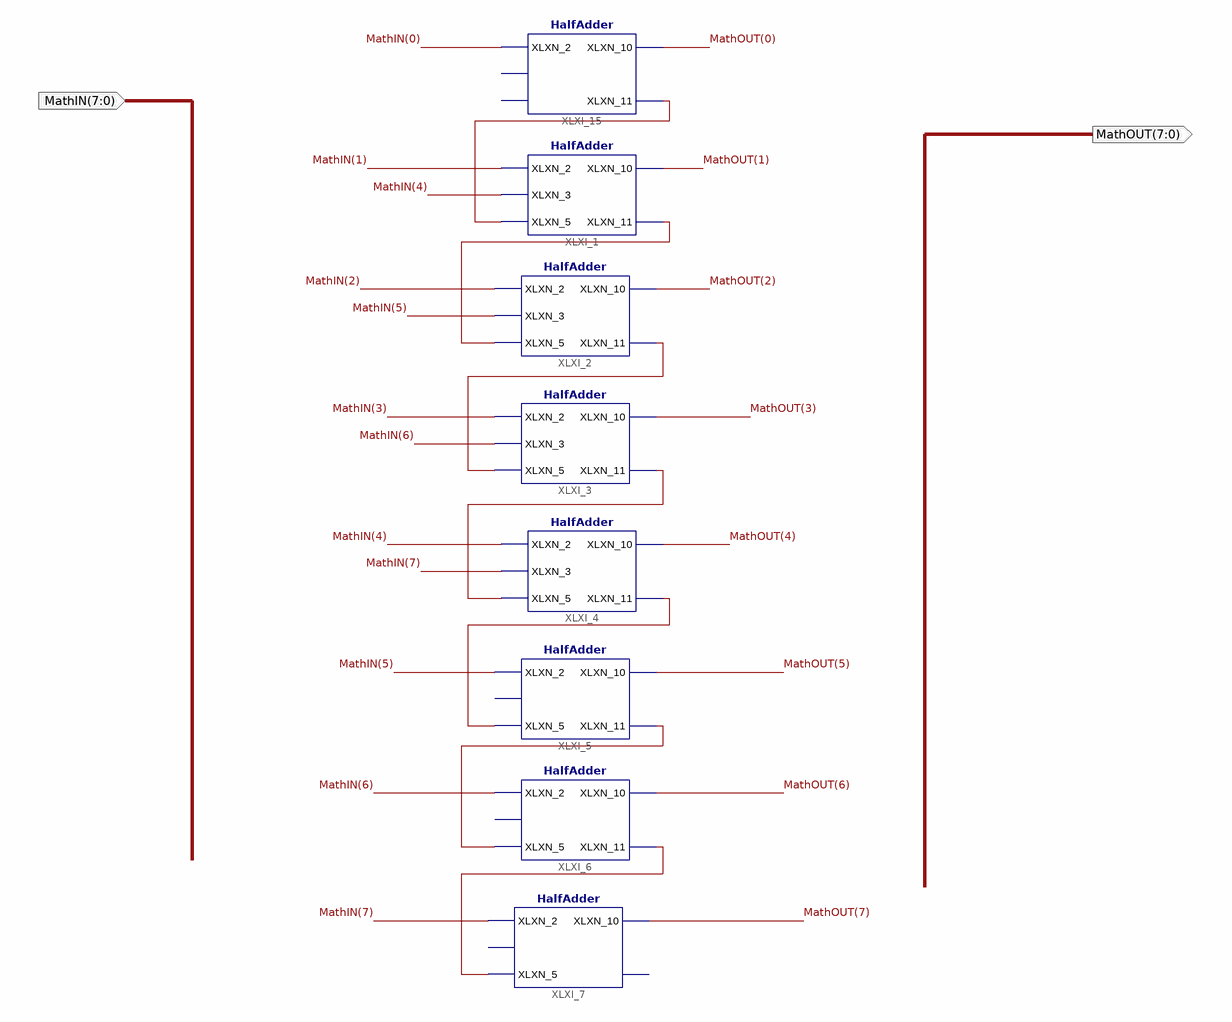
[diagram p0: schematic sheet 1]
// Xilinx ISE schematic Mathbox.sch (spartan3e) as structural Verilog: 8 symbols, 2 ports
module Mathbox (
  input  [7:0] MathIN,
  output [7:0] MathOUT
);

  wire XLXN_5, XLXN_7, XLXN_17, XLXN_19, XLXN_20, XLXN_21, XLXN_22;

  HalfAdder XLXI_2 (.XLXN_2(MathIN[2]), .XLXN_3(MathIN[5]), .XLXN_5(XLXN_7), .XLXN_10(MathOUT[2]), .XLXN_11(XLXN_17));
  HalfAdder XLXI_3 (.XLXN_2(MathIN[3]), .XLXN_3(MathIN[6]), .XLXN_5(XLXN_17), .XLXN_10(MathOUT[3]), .XLXN_11(XLXN_19));
  HalfAdder XLXI_4 (.XLXN_2(MathIN[4]), .XLXN_3(MathIN[7]), .XLXN_5(XLXN_19), .XLXN_10(MathOUT[4]), .XLXN_11(XLXN_20));
  HalfAdder XLXI_7 (.XLXN_2(MathIN[7]), .XLXN_5(XLXN_22), .XLXN_10(MathOUT[7]));  // open: XLXN_3, XLXN_11
  HalfAdder XLXI_6 (.XLXN_2(MathIN[6]), .XLXN_5(XLXN_21), .XLXN_10(MathOUT[6]), .XLXN_11(XLXN_22));  // open: XLXN_3
  HalfAdder XLXI_5 (.XLXN_2(MathIN[5]), .XLXN_5(XLXN_20), .XLXN_10(MathOUT[5]), .XLXN_11(XLXN_21));  // open: XLXN_3
  HalfAdder XLXI_1 (.XLXN_2(MathIN[1]), .XLXN_3(MathIN[4]), .XLXN_5(XLXN_5), .XLXN_10(MathOUT[1]), .XLXN_11(XLXN_7));
  HalfAdder XLXI_15 (.XLXN_2(MathIN[0]), .XLXN_10(MathOUT[0]), .XLXN_11(XLXN_5));  // open: XLXN_3, XLXN_5
endmodule
